# Altium schematic sheet External_Camera_HAT_LvlShifters.SchDoc: Sample Sheet Title
size B; Date: MM/DD/YYYY; Author: Sample Author; Organization: ORGANIZATION; Address1: ADDRESS 1; Address2: ADDRESS 2; Address3: ADDRESS 3; Address4: ADDRESS 4; Revision: -; SheetNumber: 4; SheetTotal: 4; ENG_APP_DATE: --/--/--; DSN_APP_DATE: --/--/--; CHK_APP_DATE: --/--/--
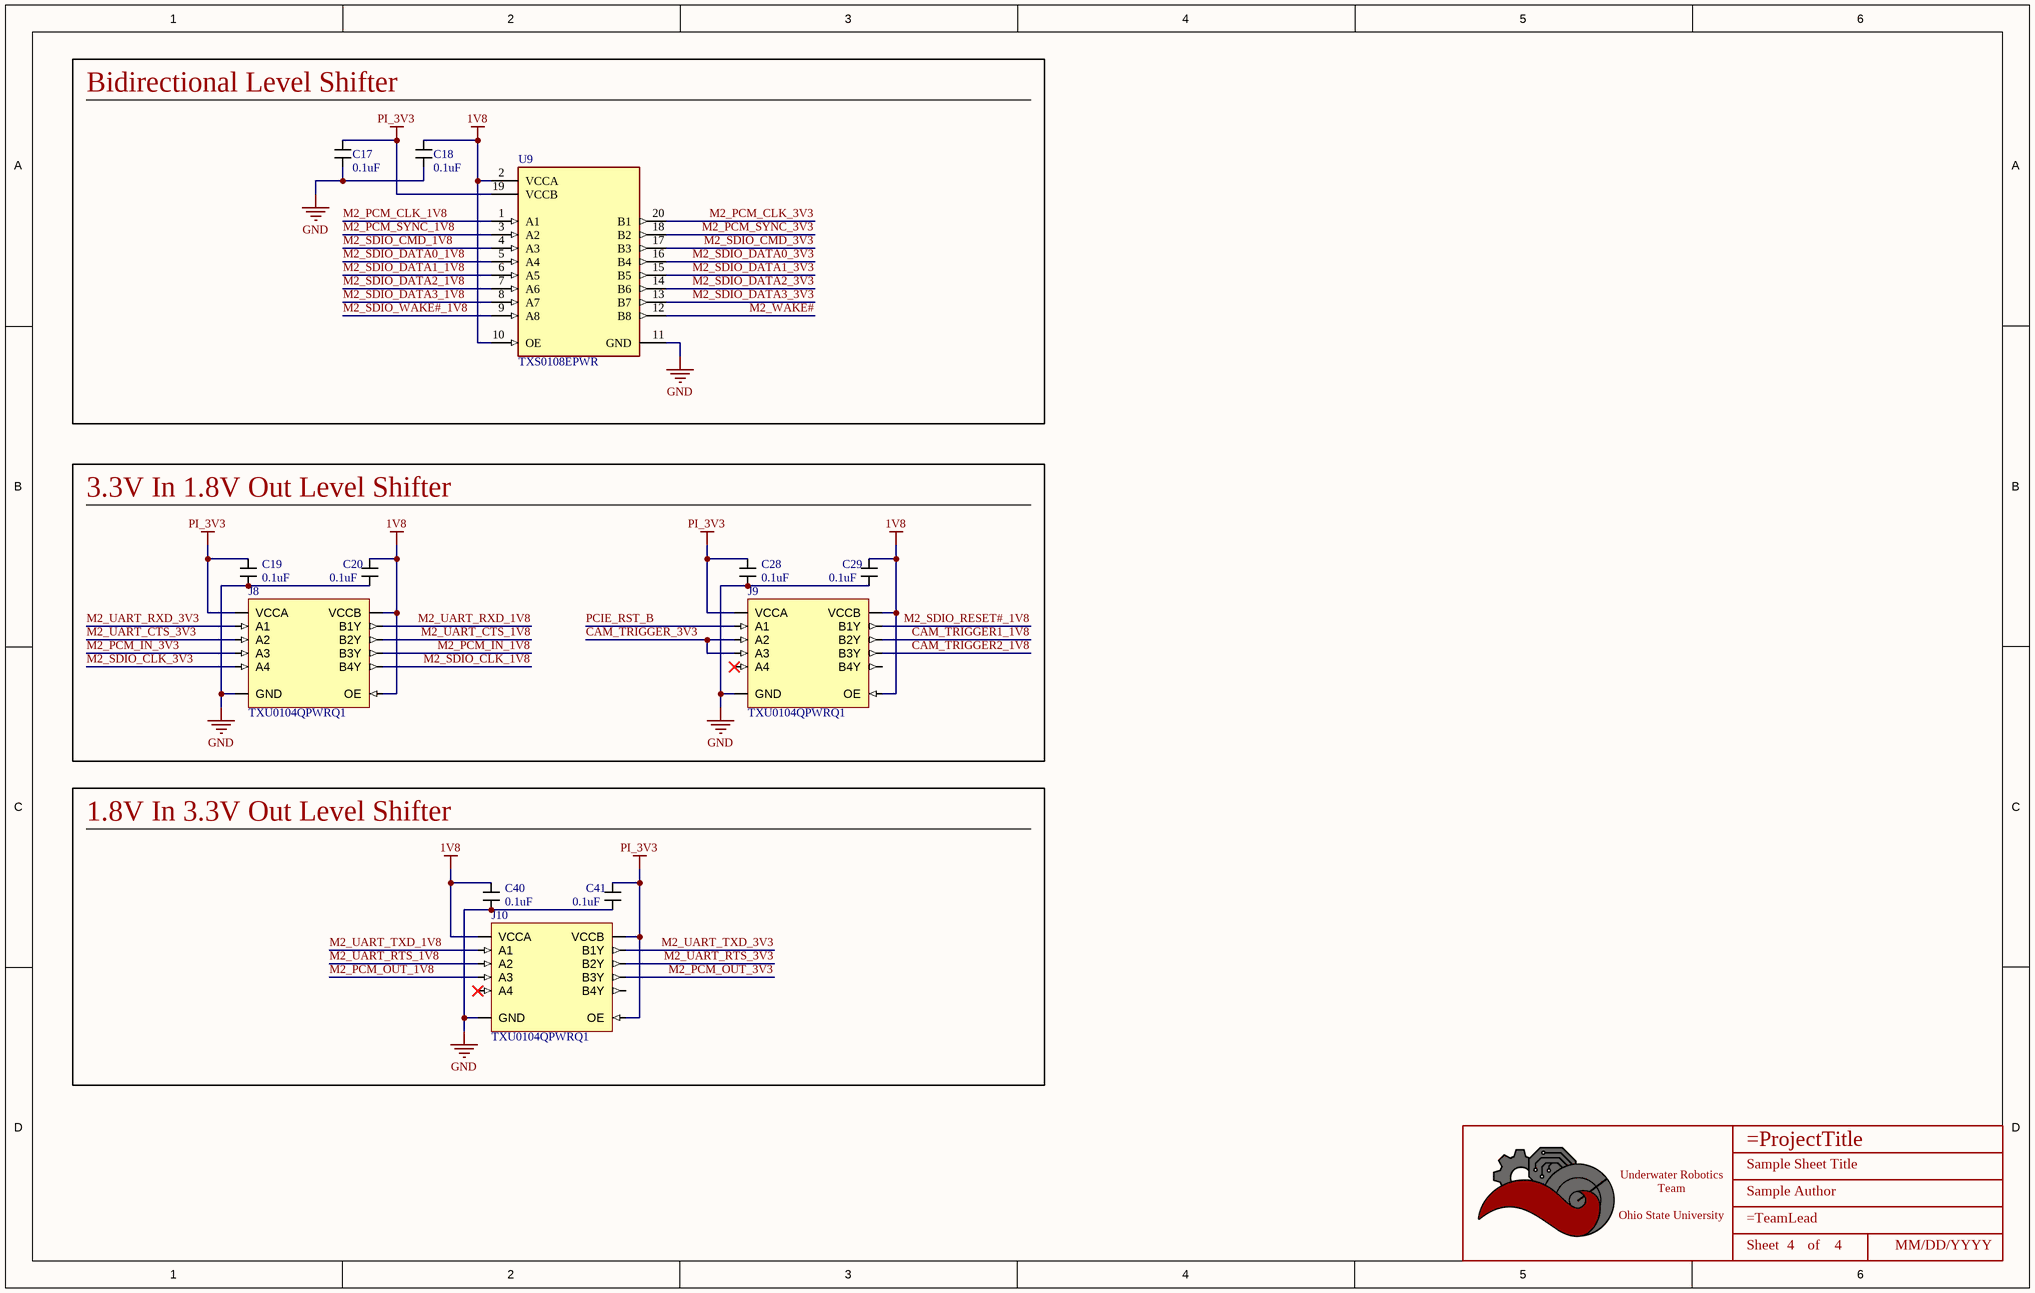
[diagram p0: External_Camera_HAT_LvlShifters.SchDoc]

## Parts
*  Title_Block  [LOGO]  (value not drawn)  (graphical)
C17  value 0.1uF  [CAPACITOR_0402]  (hidden comment: 100nF Ceramic 25V)
C18  value 0.1uF  [CAPACITOR_0402]  (hidden comment: 100nF Ceramic 25V)
C19  value 0.1uF  [CAPACITOR_0402]  (hidden comment: 100nF Ceramic 25V)
C20  value 0.1uF  [CAPACITOR_0402]  (hidden comment: 100nF Ceramic 25V)
C28  value 0.1uF  [CAPACITOR_0402]  (hidden comment: 100nF Ceramic 25V)
C29  value 0.1uF  [CAPACITOR_0402]  (hidden comment: 100nF Ceramic 25V)
C40  value 0.1uF  [CAPACITOR_0402]  (hidden comment: 100nF Ceramic 25V)
C41  value 0.1uF  [CAPACITOR_0402]  (hidden comment: 100nF Ceramic 25V)
J8  TXU0104QPWRQ1  [PW (R-PDSO-G14)]
J9  TXU0104QPWRQ1  [PW (R-PDSO-G14)]
J10  TXU0104QPWRQ1  [PW (R-PDSO-G14)]
U9  TXS0108EPWR  [FP-PW0020A-IPC_C]

## Blocks framed on the sheet
Bidirectional Level Shifter: C17 C18 U9
3.3V In 1.8V Out Level Shifter: C19 C20 C28 C29 J8 J9
1.8V In 3.3V Out Level Shifter: C40 C41 J10

## Nets
1V8: C18.1 C20.1 C29.1 C40.1 J8.8(OE) J8.14(VCCB) J9.8(OE) J9.14(VCCB) J10.1(VCCA) U9.2(VCCA) U9.10(OE)
GND: C17.2 C18.2 C19.2 C20.2 C28.2 C29.2 C40.2 C41.2 J8.7(GND) J9.7(GND) J10.7(GND) U9.11(GND)
PI_3V3: C17.1 C19.1 C28.1 C41.1 J8.1(VCCA) J9.1(VCCA) J10.8(OE) J10.14(VCCB) U9.19(VCCB)
CAM_TRIGGER1_1V8: J9.12(B2Y)
CAM_TRIGGER2_1V8: J9.11(B3Y)
CAM_TRIGGER_3V3: J9.3(A2) J9.4(A3)
M2_PCM_CLK_1V8: U9.1(A1)
M2_PCM_CLK_3V3: U9.20(B1)
M2_PCM_IN_1V8: J8.11(B3Y)
M2_PCM_IN_3V3: J8.4(A3)
M2_PCM_OUT_1V8: J10.4(A3)
M2_PCM_OUT_3V3: J10.11(B3Y)
M2_PCM_SYNC_1V8: U9.3(A2)
M2_PCM_SYNC_3V3: U9.18(B2)
M2_SDIO_CLK_1V8: J8.10(B4Y)
M2_SDIO_CLK_3V3: J8.5(A4)
M2_SDIO_CMD_1V8: U9.4(A3)
M2_SDIO_CMD_3V3: U9.17(B3)
M2_SDIO_DATA0_1V8: U9.5(A4)
M2_SDIO_DATA0_3V3: U9.16(B4)
M2_SDIO_DATA1_1V8: U9.6(A5)
M2_SDIO_DATA1_3V3: U9.15(B5)
M2_SDIO_DATA2_1V8: U9.7(A6)
M2_SDIO_DATA2_3V3: U9.14(B6)
M2_SDIO_DATA3_1V8: U9.8(A7)
M2_SDIO_DATA3_3V3: U9.13(B7)
M2_SDIO_RESET#_1V8: J9.13(B1Y)
M2_SDIO_WAKE#_1V8: U9.9(A8)
M2_UART_CTS_1V8: J8.12(B2Y)
M2_UART_CTS_3V3: J8.3(A2)
M2_UART_RTS_1V8: J10.3(A2)
M2_UART_RTS_3V3: J10.12(B2Y)
M2_UART_RXD_1V8: J8.13(B1Y)
M2_UART_RXD_3V3: J8.2(A1)
M2_UART_TXD_1V8: J10.2(A1)
M2_UART_TXD_3V3: J10.13(B1Y)
M2_WAKE#: U9.12(B8)
PCIE_RST_B: J9.2(A1)

Not connected (* = marked no-connect by the designer): J9 5(A4)* 10(B4Y); J10 5(A4)* 10(B4Y)

## Notes on the sheet
- DWG. NO.
- REV.
- SHT.
- THIS DOCUMENT AND THE DATA DISCLOSED HEREIN OR HEREWITH IS THE PROPERTY OF ALTIUM LIMITED AND MAY BE FREELY DISTRIBUTED IN WHOLE. NO RIGHTS ARE RESERVED OR EXPRESS OR IMPLIED WARANTEE GIVEN.
- REVISION
- DESCRIPTION
- DATE
- APPROVED
- ENG:
- APPROVALS
- PROJECT
- DSN:
- CHK:
- REFERENCE DOCUMENTS
- PROJECT REVISION:
- TITLE
- DOCUMENT REVISION:
- DESIGN ITEM:
- BOM:
- FAB DWG:
- PCB DWG:
- ASSY DWG:
- SCALE:
- SIZE
- B
- CAGE CODE
- FILE NAME
- DWG NO.
- SHEET
- OF
- REV
- (in symbol Title_Block) Underwater Robotics Team / Ohio State University; Sheet; of

## Library data of the parts
* = Title_Block: UWRT Schematic Title Block Template / Created June 2021, Dylan Trainor
C17-C20 C28 C29 C40 C41 = CAPACITOR_0.1uF_0402: Cap 100nF 25V +/-10% / Ceramic 0402; Made By: Robert Pafford; Tolerance: +/- 10%; Voltage: 25V; Supplier 1: Digi-Key; Supplier Part Number 1: 478-7868-1-ND
J8-J10 = TXU0104QPWRQ1: Voltage Level Translator Unidirectional 1 Circuit 4 Channel 200Mbps 14-TSSOP; Made By: Robert Pafford; Voltage Range: 1.1~5.5V; Channels: 4; Channel Type: Unidirectional; Max Rate: 200Mbps; Supplier 1: Digi-Key; Supplier Part Number 1: 296-TXU0104QPWRQ1CT-ND
U9 = CMP-2000-04956-2: IC TRNSLTR BIDIRECTIONAL 20TSSOP; Number of Inputs: 8; Supply Current: 8uA; Low Level Output Current: 50mA; Min Supply Voltage: 1.2V; Quiescent Current: 3uA; Output Type: Voltage; Propagation Delay: 4.8ns; Max Supply Voltage: 5.5V; Output Current: 620uA; Turn-On Delay Time: 312ns; Logic Function: Translator; Data Rate: 60Mbps; Rise Time: 6.3ns; High Level Output Current: -50mA; Number of Pins: 20; Packaging: Tape and Reel; Max Operating Temperature: 85°C; Height: 1.15mm; Nominal Supply Current: 8uA; Termination: SMD/SMT; Lead Free: Lead Free; Package Quantity: 1; Number of Bits: 8; Weight: 0.002716oz; Contact Plating: Gold; Series: -; Width: 4.4mm; Radiation Hardening: No; Mount: Surface Mount; Length: 6.5mm; Case/Package: TSSOP; REACH SVHC: No SVHC; RoHS Compliant: Yes; Min Operating Temperature: -40°C; Number of Channels: 8